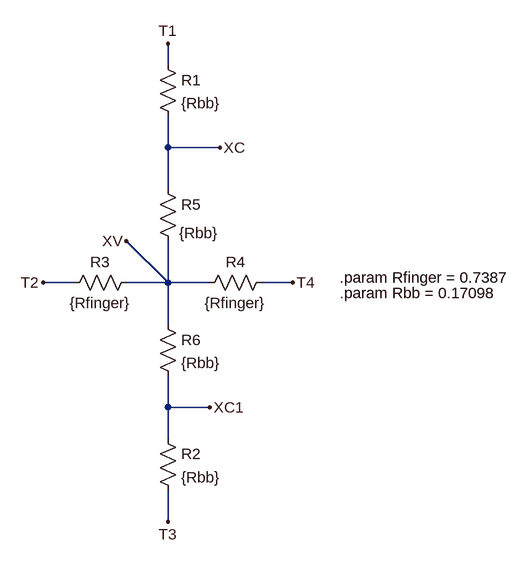
[diagram p0: schematic IVTopElement.asc]
IVTopElement.asc, the LTspice schematic file:
Version 4
SHEET 1 880 704
WIRE 176 -96 176 -128
WIRE 176 32 176 -16
WIRE 256 32 176 32
WIRE 176 96 176 32
WIRE 32 240 -16 240
WIRE 176 240 112 176
WIRE 176 240 176 176
WIRE 176 240 112 240
WIRE 240 240 176 240
WIRE 368 240 320 240
WIRE 176 304 176 240
WIRE 176 432 176 384
WIRE 240 432 176 432
WIRE 176 480 176 432
WIRE 176 608 176 560
FLAG 176 -128 T1
FLAG 176 608 T3
FLAG -16 240 T2
FLAG 368 240 T4
FLAG 256 32 XC
FLAG 240 432 XC1
FLAG 112 176 XV
SYMBOL res 160 -112 R0
SYMATTR InstName R1
SYMATTR Value {Rbb}
SYMBOL res 160 464 R0
SYMATTR InstName R2
SYMATTR Value {Rbb}
SYMBOL res 128 224 R90
WINDOW 0 0 56 VBottom 2
WINDOW 3 32 56 VTop 2
SYMATTR InstName R3
SYMATTR Value {Rfinger}
SYMBOL res 336 224 R90
WINDOW 0 0 56 VBottom 2
WINDOW 3 32 56 VTop 2
SYMATTR InstName R4
SYMATTR Value {Rfinger}
SYMBOL res 160 80 R0
WINDOW 3 33 84 Left 2
SYMATTR Value {Rbb}
SYMATTR InstName R5
SYMBOL res 160 288 R0
SYMATTR InstName R6
SYMATTR Value {Rbb}
TEXT 440 232 Left 2 !.param Rfinger = 0.7387
TEXT 440 256 Left 2 !.param Rbb = 0.17098

The netlist it stands for:
* IVTopElement.asc
R1 T1 XC {Rbb}
R2 XC1 T3 {Rbb}
R3 XV T2 {Rfinger}
R4 T4 XV {Rfinger}
R5 XC XV {Rbb}
R6 XV XC1 {Rbb}
.param Rfinger = 0.7387
.param Rbb = 0.17098
.backanno
.end